# EAGLE design DiffController (EAGLE 9.6.2)
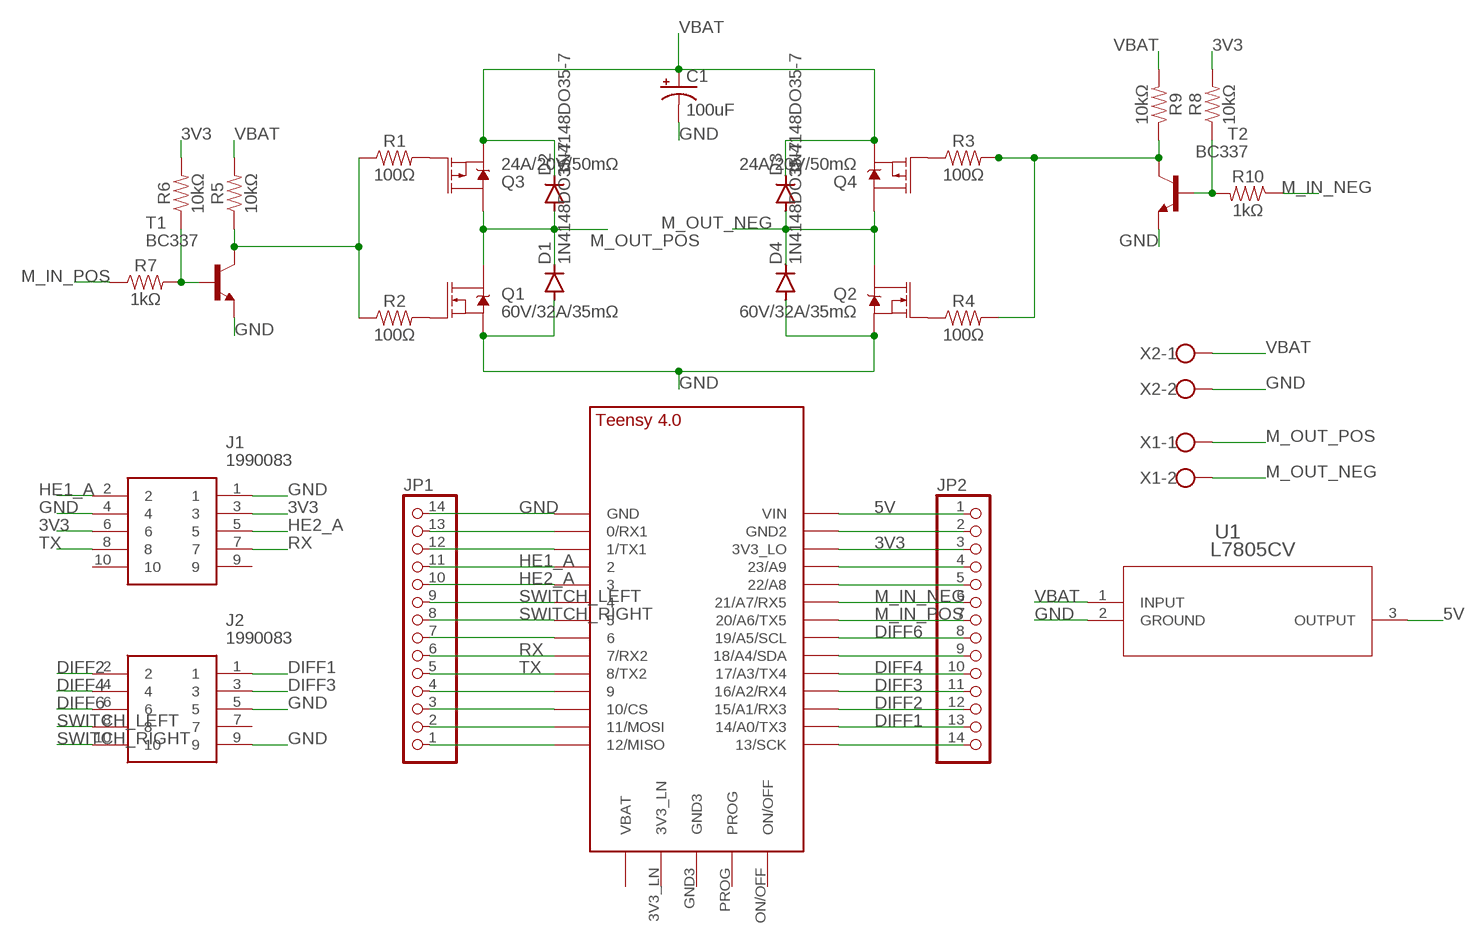
[diagram p0: schematic, sheet 1]

## Parts
C1  100uF  100UF-POLAR-RADIAL-2.5MM-25V-20%  [CPOL-RADIAL-2.5MM-6.5MM]
D1  1N4148DO35-7  [DO35-7]
D2  1N4148DO35-7  [DO35-7]
D3  1N4148DO35-7  [DO35-7]
D4  1N4148DO35-7  [DO35-7]
J1  1990083  [1990083]
J2  1990083  [1990083]
JP1  PINHD-1X14  [1X14]
JP2  PINHD-1X14  [1X14]
Q1  60V/32A/35mΩ  MOSFET-NCH-FQP30N06L  [TO220V]
Q2  60V/32A/35mΩ  MOSFET-NCH-FQP30N06L  [TO220V]
Q3  24A/20V/50mΩ  MOSFET_PCH-NDP6020P  [TO220V]
Q4  24A/20V/50mΩ  MOSFET_PCH-NDP6020P  [TO220V]
R1  100Ω  RESISTORAXIAL-0.3  [AXIAL-0.3]
R2  100Ω  RESISTORAXIAL-0.3  [AXIAL-0.3]
R3  100Ω  RESISTORAXIAL-0.3  [AXIAL-0.3]
R4  100Ω  RESISTORAXIAL-0.3  [AXIAL-0.3]
R5  10kΩ  RESISTORAXIAL-0.3  [AXIAL-0.3]
R6  10kΩ  RESISTORAXIAL-0.3  [AXIAL-0.3]
R7  1kΩ  RESISTORAXIAL-0.3  [AXIAL-0.3]
R8  10kΩ  RESISTORAXIAL-0.3  [AXIAL-0.3]
R9  10kΩ  RESISTORAXIAL-0.3  [AXIAL-0.3]
R10  1kΩ  RESISTORAXIAL-0.3  [AXIAL-0.3]
T1  BC337  [TO92]
T2  BC337  [TO92]
U1  L7805CV  [TO-220_STM]
U$2  TEENSY_4.0_EXPANDED_1  [TEENSY_4.0_EXPANDED_1]
X1  W237-102  [W237-102]
X2  W237-102  [W237-102]

## Nets
3V3: J1.3 J1.6 JP2.3 R6.P$2 R8.P$2 U$2.3V3_LO
5V: JP2.1 U1.3(OUTPUT) U$2.VIN
DIFF1: J2.1 JP2.13 U$2.14/A0(14/A0/TX3)
DIFF2: J2.2 JP2.12 U$2.15/A1(15/A1/RX3)
DIFF3: J2.3 JP2.11 U$2.16/A2(16/A2/RX4)
DIFF4: J2.4 JP2.10 U$2.17/A3(17/A3/TX4)
DIFF6: J2.6 JP2.8 U$2.19/A5/SCL
GND: C1.2(-) D1.A D4.A J1.1 J1.4 J2.5 J2.9 JP1.14 Q1.3(S) Q2.3(S) T1.1(E) T2.1(E) U1.2(GROUND) U$2.GND X2.2
HE1_A: J1.2 JP1.11 U$2.2
HE2_A: J1.5 JP1.10 U$2.3/CANTX
M_IN_NEG: JP2.6 R10.P$1 U$2.21/A7(21/A7/RX5)
M_IN_POS: JP2.7 R7.P$1 U$2.20/A6(20/A6/TX5)
M_OUT_NEG: D3.A D4.C Q2.2(D) Q4.2(D) X1.2
M_OUT_POS: D1.C D2.A Q1.2(D) Q3.2(D) X1.1
N$1: JP2.9 U$2.18/A4/SDA
N$2: JP2.4 U$2.23/A9
N$3: JP1.13 U$2.0/RX(0/RX1)
N$4: JP1.12 U$2.1/TX(1/TX1)
N$5: JP2.2 U$2.GND2
N$6: JP1.4 U$2.9/CS
N$7: JP1.3 U$2.10/CS
N$8: JP1.2 U$2.11/MOSI
N$9: JP1.1 U$2.12/MISO
N$10: JP2.14 U$2.13/SCK
N$11: JP1.7 U$2.6
N$12: JP2.5 U$2.22/A8
N$13: Q1.1(G) R2.P$2
N$14: Q2.1(G) R4.P$1
N$15: Q3.1(G) R1.P$2
N$16: Q4.1(G) R3.P$1
N$17: R3.P$2 R4.P$2 R9.P$1 T2.3(C)
N$18: R6.P$1 R7.P$2 T1.2(B)
N$19: R1.P$1 R2.P$1 R5.P$1 T1.3(C)
N$20: R8.P$1 R10.P$2 T2.2(B)
RX: J1.7 JP1.6 U$2.7(7/RX2)
SWITCH_LEFT: J2.8 JP1.9 U$2.4/CANRX
SWITCH_RIGHT: J2.10 JP1.8 U$2.5
TX: J1.8 JP1.5 U$2.8(8/TX2)
VBAT: C1.1(+) D2.C D3.C Q3.3(S) Q4.3(S) R5.P$2 R9.P$2 U1.1(INPUT) X2.1
Unconnected: J1.9 J1.10 J2.7 U$2.3V3_LN U$2.GND3 U$2.ON/OFF U$2.PROG U$2.VBAT\(VBAT)

## Library data of the parts
C1 = SparkFun-Capacitors:100UF-POLAR: 100µF polarized capacitors A capacitor is a passive two-terminal electrical component used to store electrical energy temporarily in an electric field.; PROD_ID: CAP-08439
D1-D4 = diode:1N4148: DIODE high speed (Philips)
J1 J2 = 1990083:1990083: Phoenix Contact PTSA 0.5/10-2.5-Z Non-Fused Terminal Block, 10 Way/Pole, Solder Terminals, 24 20 AWG Source: Datasheet <https://www.phoenixcontact.com/online/portal/in/?uri=pxc-oc-itemdetail:pid=1990083&library=inen&pcck=P-11-01-05&tab=1&selectedCategory=ALL>; ARROW_PART_NUMBER: 1990083; ARROW_PRICE-STOCK: https://www.arrow.com/en/products/1990083/phoenix-contact; DESCRIPTION: Phoenix Contact PTSA 0.5/10-2.5-Z Non-Fused Terminal Block, 10 Way/Pole, Solder Terminals, 24 20 AWG; HEIGHT: 13.1mm; MANUFACTURER_NAME: Phoenix Contact; MANUFACTURER_PART_NUMBER: 1990083; MOUSER_PART_NUMBER: 651-1990083; MOUSER_PRICE-STOCK: https://www.mouser.co.uk/ProductDetail/Phoenix-Contact/1990083?qs=eiqBpq341KUxP7V1ZFOCBQ%3D%3D
JP1 JP2 = Connectors:PINHD-1X14: PIN HEADER
Q1 Q2 = SparkFun-DiscreteSemi:MOSFET-NCH: N-channel MOSFETs Voltage controlled devices that allow control of high current outputs. SparkFun Products: SparkFun OpenScale <https://www.sparkfun.com/products/13261> SparkFun Digital Sandbox <https://www.sparkfun.com/products/12651> SparkFun Monster Moto Shield <https://www.sparkfun.com/products/10182> SparkFun MOSFET Power Controller <https://www.sparkfun.com/products/11214>; PROD_ID: TRANS-10060
Q3 Q4 = SparkFun-DiscreteSemi:MOSFET_PCH: P-channel MOSFETs Voltage controlled devices that allow control of high current outputs. SparkFun Products: SparkFun ESP32 Thing <https://www.sparkfun.com/products/13907> SparkFun ESP8266 Thing <https://www.sparkfun.com/products/13231>; PROD_ID: TRANS-13060
R1-R10 = SparkFun-Resistors:RESISTOR: Generic Resistor Package
T1 T2 = transistor:BC337: NPN TRANSISTOR
U1 = L7805CV:L7805CV; BUILT_BY: EMA_UL_Team; MANUFACTURER_PART_NUMBER: L7805CV; SOURCELIBRARY: Updates_to_database_2020-11-10; VENDOR: STMicroelectronics
U$2 = Microcontroller:TEENSY_4.0_EXPANDED_1
X1 X2 = con-wago-500:W237-102: WAGO SCREW CLAMP; MPN: 237-102; OC_FARNELL: unknown; OC_NEWARK: 70K9898

## Board
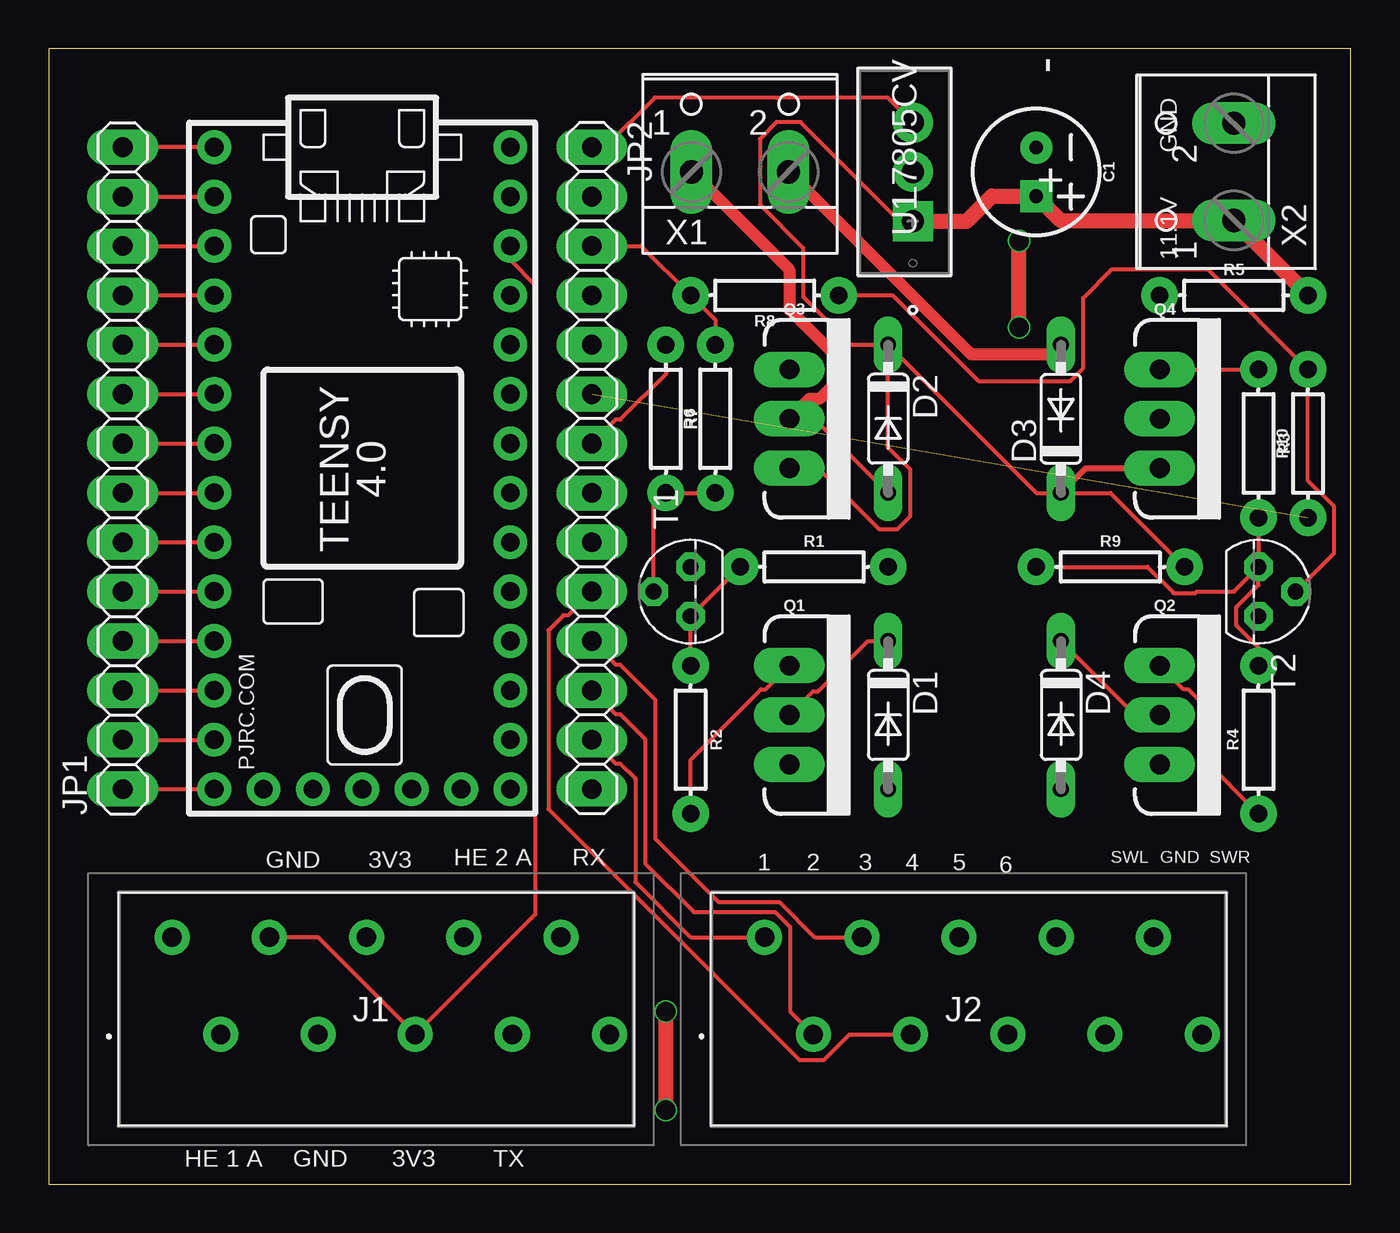
[diagram p1: board, top side]
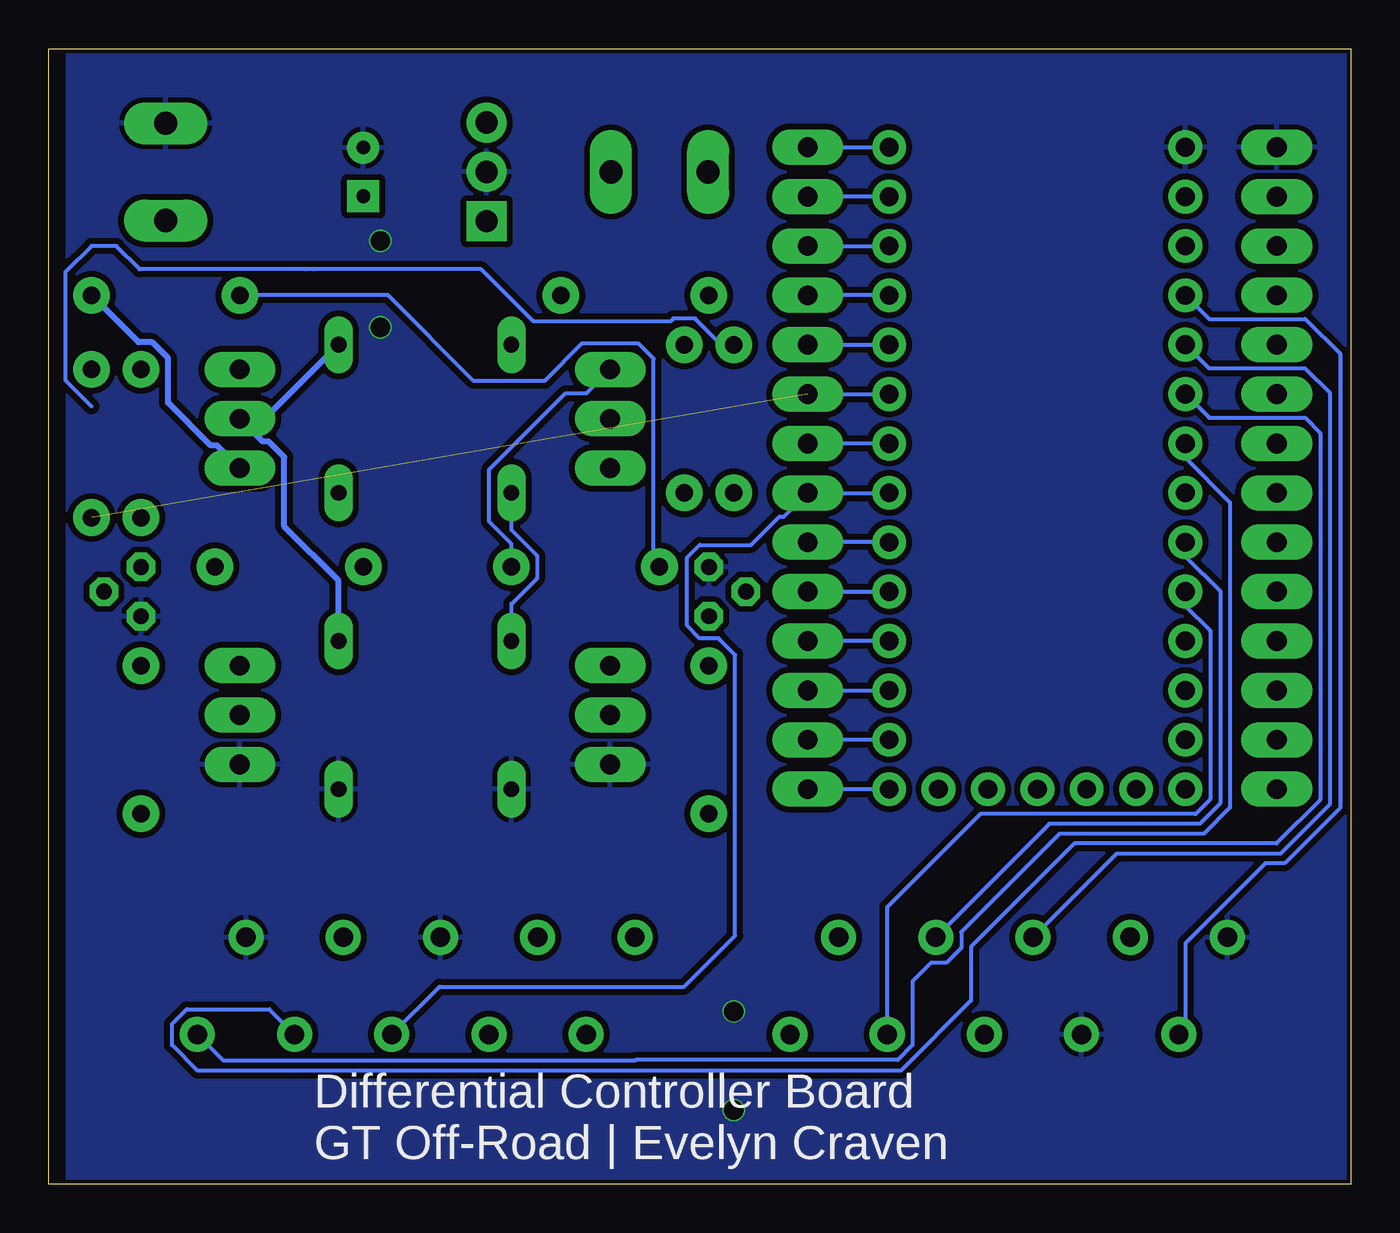
[diagram p2: board, bottom side, seen from below]

Size 66.98 x 58.41 mm. Coordinates in mm from the lower left corner, seen from the top.
Outline: 0,0 66.98,0 66.98,58.41 0,58.41 0,0
Copper layers (1*16): Top 0.035mm / dielectric 1.6mm / Bottom 0.035mm
Design rules "jlcpcb-2layers *": minimum track width 8mil, minimum drill 0.3mm, track to track 12mil, track to pad 12mil, pad to pad 12mil, via to via 12mil, smd to smd 5mil, copper to edge 0.2mm, drill to drill 6mil, minimum pad ring 10mil, minimum via ring 3mil, stop-mask expansion 4mil, vias tented up to drill 0mil, thermal gap 10mil

### Footprints (pad centres in the part's own frame; a part is rotated, then mirrored left to right if it is on the bottom)
CPOL-RADIAL-2.5MM-6.5MM = drill 0.7 pad 1.651 square: 1 1.25,0 | drill 0.7 pad 1.651: 2 -1.25,0
DO35-7 = drill 0.813 long: A 3.81,0; C -3.81,0
1990083 = drill 1 pad 1.5: 1 0,0; 2 2.5,-5; 3 5,0; 4 7.5,-5; 5 10,0; 6 12.5,-5; 7 15,0; 8 17.5,-5; 9 20,0; 10 22.5,-5
1X14 = drill 1.016 long: 1 -16.51,0; 2 -13.97,0; 3 -11.43,0; 4 -8.89,0; 5 -6.35,0; 6 -3.81,0; 7 -1.27,0; 8 1.27,0; 9 3.81,0; 10 6.35,0; 11 8.89,0; 12 11.43,0; 13 13.97,0; 14 16.51,0
TO220V = drill 1.016 long: 1 -2.54,0; 2 0,0; 3 2.54,0
AXIAL-0.3 = drill 0.9 pad 1.88: P$1 -3.81,0; P$2 3.81,0
TO92 = drill 0.813 octagon: 1 1.27,0; 2 0,1.905; 3 -1.27,0
TO-220_STM = drill 1.143 pad 1.651 square: 1 0,0 | drill 1.143 pad 1.651: 2 2.54,0; 3 5.08,0
TEENSY_4.0_EXPANDED_1 = drill 0.965: 0/RX -13.97,-7.62; 1/TX -11.43,-7.62; 2 -8.89,-7.62; 3/CANTX -6.35,-7.62; 3V3_LN 16.51,-2.54; 3V3_LO -11.43,7.62; 4/CANRX -3.81,-7.62; 5 -1.27,-7.62; 6 1.27,-7.62; 7 3.81,-7.62; 8 6.35,-7.62; 9/CS 8.89,-7.62; 10/CS 11.43,-7.62; 11/MOSI 13.97,-7.62; 12/MISO 16.51,-7.62; 13/SCK 16.51,7.62; 14/A0 13.97,7.62; 15/A1 11.43,7.62; 16/A2 8.89,7.62; 17/A3 6.35,7.62; 18/A4/SDA 3.81,7.62; 19/A5/SCL 1.27,7.62; 20/A6 -1.27,7.62; 21/A7 -3.81,7.62; 22/A8 -6.35,7.62; 23/A9 -8.89,7.62; GND -16.51,-7.62; GND2 -13.97,7.62; GND3 16.51,0; ON/OFF 16.51,5.08; PROG 16.51,2.54; VBAT\ 16.51,-5.08; VIN -16.51,7.62
W237-102 = drill 1.194 long: 1 -2.5,-1.27; 2 2.5,-1.27

### Placement (x,y rotation side)
C1  50.8,52.07 270 top
D1  43.18,24.13 270 top
D2  43.18,39.37 270 top
D3  52.07,39.37 90 top
D4  52.07,24.13 270 top
J1  6.35,12.7 0 top
J2  36.83,12.7 0 top
JP1  3.81,36.83 90 top
JP2  27.94,36.83 270 top
Q1  38.1,24.13 270 top
Q2  57.15,24.13 270 top
Q3  38.1,39.37 270 top
Q4  57.15,39.37 270 top
R1  39.37,31.75 0 top
R2  33.02,22.86 270 top
R3  62.23,38.1 270 top
R4  62.23,22.86 90 top
R5  60.96,45.72 0 top
R6  34.29,39.37 90 top
R7  31.75,39.37 270 top
R8  36.83,45.72 180 top
R9  54.61,31.75 0 top
R10  64.77,38.1 90 top
T1  33.02,30.48 90 top
T2  62.23,30.48 270 top
U1  44.45,49.53 90 top
U$2  16.13,36.83 270 top
X1  35.56,53.34 0 top
X2  59.69,52.07 90 top

### Tracks (layer width: path | path; a pad name or v marks a point on that pad's centre or on a via)
3V3
  Top 0.203: U$2.3V3_LO 23.75,47.52 25.02,46.25 25.02,13.87 J1.6 13.85,12.7 J1.3 | JP2.3 30.48,48.26 R8.P$2 34.29,44.45 R6.P$2
  Bottom 0.203: JP2.3 U$2.3V3_LO
5V
  Top 0.203: JP2.1 28.62,53.34 31.18,55.89 37.4,55.89 37.42,55.88 43.18,55.88 U1.3
  Bottom 0.203: JP2.1 U$2.VIN
DIFF1
  Top 0.203: JP2.13 29.16,21.64 29.4,21.64 30.18,20.87 30.18,15.55 33.02,12.7 J2.1
  Bottom 0.203: U$2.14/A0 JP2.13
DIFF2
  Top 0.203: JP2.12 29.16,24.18 29.4,24.18 30.68,22.9 30.68,16.51 33.19,14.01 37.37,14.01 38.14,13.24 38.14,8.89 J2.2
  Bottom 0.203: JP2.12 U$2.15/A1
DIFF3
  Top 0.203: JP2.11 29.16,26.72 29.4,26.72 31.19,24.93 31.19,17.78 34.46,14.51 37.58,14.51 39.4,12.7 J2.3
  Bottom 0.203: U$2.16/A2 JP2.11
DIFF4
  Top 0.203: JP2.10 26.72,29.26 26.48,29.26 25.7,28.49 25.7,19.3 38.61,6.39 39.87,6.39 41.18,7.7 J2.4
  Bottom 0.203: JP2.10 U$2.17/A3
DIFF6
  Bottom 0.203: U$2.19/A5/SCL JP2.8 29.16,34.34 29.4,34.34 30.85,32.89 33.49,32.89 34.16,32.22 34.16,28.74 33.49,28.07 32.52,28.07 31.67,27.23 31.67,12.78 34.29,10.16 46.87,10.16 J2.6
GND  (via drill 1)
  Top 0.203: U$2.GND JP1.14
  Top 0.762: 50.78,53.34 C1.2 | v31.75,3.81 v31.75,8.89 | v49.91,44.07 v49.91,48.51
  pour Bottom: 0,58.42 66.04,58.42 66.04,0 0,0
HE1_A
  Top 0.203: JP1.11 U$2.2
  Bottom 0.203: J1.2 8.51,8.04 8.51,12.39 4.39,16.5 3.41,16.5 0.56,19.35 0.56,42.71 2.35,44.5 7.29,44.5 U$2.2
HE2_A
  Top 0.203: JP1.10 U$2.3/CANTX
  Bottom 0.203: J1.5 12.04,17.01 3.62,17.01 1.07,19.56 1.07,40.68 2.35,41.96 7.29,41.96 U$2.3/CANTX
M_IN_NEG  (1 unrouted)
  Bottom 0.203: JP2.6 U$2.21/A7
M_IN_POS
  Top 0.203: JP2.7 29.16,39.32 29.4,39.32 31.75,41.67 R7.P$1
  Bottom 0.203: U$2.20/A6 JP2.7 | R7.P$1 32.39,43.18 33.73,44.53 34.85,44.53 35,44.37 42.03,44.37 44.73,47.07 53.34,47.07 53.75,47.07 62.31,47.07 63.5,48.26 64.77,48.26 66.12,46.91 66.12,41.35 64.77,40.01
M_OUT_NEG
  Top 0.203: D4.C 55.88,24.13 Q2.2
  Top 0.61: X1.2 47.46,42.67 51.56,42.67 D3.A
  Bottom 0.305: D4.C 52.07,31.04 54.86,33.84 54.86,37.4 55.67,38.2 55.98,38.2 Q4.2 55.88,39.37 D3.A
M_OUT_POS
  Top 0.203: Q1.2 39.32,25.35 39.56,25.35 42.15,27.94 D1.C | Q3.2 39.37,39.37 D2.A
  Top 0.61: X1.1 38.1,47.03 38.1,44.98 40.54,42.54 40.54,41.28 39.65,40.39 39.12,40.39 Q3.2
  Bottom 0.203: D1.C 43.18,29.85 41.83,31.19 41.83,32.31 43.18,33.65 D2.A
N$1
  Bottom 0.203: U$2.18/A4/SDA JP2.9
N$2
  Bottom 0.203: U$2.23/A9 JP2.4
N$3
  Top 0.203: JP1.13 U$2.0/RX
N$4
  Top 0.203: JP1.12 U$2.1/TX
N$5
  Bottom 0.203: U$2.GND2 JP2.2
N$6
  Top 0.203: JP1.4 U$2.9/CS
N$7
  Top 0.203: JP1.3 U$2.10/CS
N$8
  Top 0.203: JP1.2 U$2.11/MOSI
N$9
  Top 0.203: JP1.1 U$2.12/MISO
N$10
  Bottom 0.203: JP2.14 U$2.13/SCK
N$11
  Top 0.203: JP1.7 U$2.6
N$12
  Bottom 0.203: JP2.5 U$2.22/A8
N$13
  Top 0.203: Q1.1 36.88,25.45 36.64,25.45 33.02,21.83 R2.P$2
N$14
  Top 0.203: R4.P$1 59.38,21.89 59.38,24.68 58.61,25.45 58.37,25.45 Q2.1
N$15
  Bottom 0.203: R1.P$2 43.18,32.93 44.32,34.07 44.32,36.76 40.39,40.69 39.32,40.69 Q3.1
N$16
  Top 0.203: Q4.1 R3.P$1
N$17
  Top 0.203: R4.P$2 62.23,27.6 61.09,28.74 61.09,29.68 62.23,30.82 T2.3 | R9.P$1 56.52,31.75 57.86,30.4 58.98,30.4 59.05,30.48 60.96,30.48 T2.3 | R3.P$2 T2.3
N$18
  Top 0.203: T1.2 31.11,34.92 R7.P$2 R6.P$1
N$19
  Top 0.203: R2.P$1 T1.3 R1.P$1
  Bottom 0.203: R5.P$1 49.53,45.72 45.12,41.31 41.48,41.31 39.56,43.23 36.64,43.23 35.87,42.46 35.87,32.05 R1.P$1
N$20
  Top 0.203: R8.P$1 43.4,45.72 47.81,41.31 52.54,41.31 53.21,41.98 53.21,45.59 54.69,47.07 59.61,47.07 R10.P$2 64.77,36.19 66.12,34.85 66.12,32.46 T2.2
RX
  Top 0.203: JP1.6 U$2.7
  Bottom 0.203: J1.7 15.51,18.54 7.77,18.54 6.73,19.58 6.73,30.5 8.51,32.28 U$2.7
SWITCH_LEFT
  Top 0.203: JP1.9 U$2.4/CANRX
  Bottom 0.203: U$2.4/CANRX 7.29,39.42 2.35,39.42 1.57,38.65 1.57,19.77 3.83,17.52 14.23,17.52 19.54,12.21 19.54,9.45 23.14,5.84 59.32,5.84 60.64,7.16 60.64,8.24 59.87,9.01 55.64,9.01 J2.8
SWITCH_RIGHT
  Top 0.203: JP1.8 U$2.5
  Bottom 0.203: U$2.5 8.51,37.36 6.22,35.07 6.22,19.37 7.56,18.03 14.99,18.03 20.04,12.98 20.04,12.16 20.81,11.39 21.59,11.39 22.54,10.44 22.54,7.16 23.31,6.39 36.79,6.39 36.83,6.35 57.98,6.35 J2.10
TX
  Top 0.203: JP1.5 U$2.8
  Bottom 0.203: U$2.8 8.51,29.74 7.23,28.47 7.23,19.79 7.98,19.05 19.05,19.05 23.85,14.25 J1.8
VBAT
  Top 0.203: U1.1 43.77,49.53 38.67,54.62 37.45,54.62 36.58,53.76 36.58,50.38 38.81,48.15 38.81,45.64 41.28,43.18 D2.C | Q3.3 39.57,36.83 42.71,33.69 43.65,33.69 44.32,34.36 44.32,36.76 43.18,37.9 D2.C | D2.C 50.8,35.56 D3.C 54.61,35.56 R9.P$2
  Top 0.305: D3.C 53.34,36.83 Q4.3
  Top 0.762: U1.1 47.22,49.53 48.51,50.82 C1.1 52.05,49.57 X2.1 64.77,45.76 R5.P$2
  Bottom 0.305: R5.P$2 62.36,43.31 61.65,43.31 60.83,42.49 60.83,40.2 58.63,38 58.32,38 Q4.3

### Text on the board
tPlace: - | GND | + | 11.1V | GND | 3V3 | HE 2 A | RX | SWL | GND | SWR | 1 | 2 | 3 | 4 | 5 | 6 | HE 1 A | GND | 3V3 | TX
bPlace: Differential Controller Board / GT Off-Road | Evelyn Craven